# EAGLE schematic SDA390V1_TASLAK (EAGLE 9.6.2)
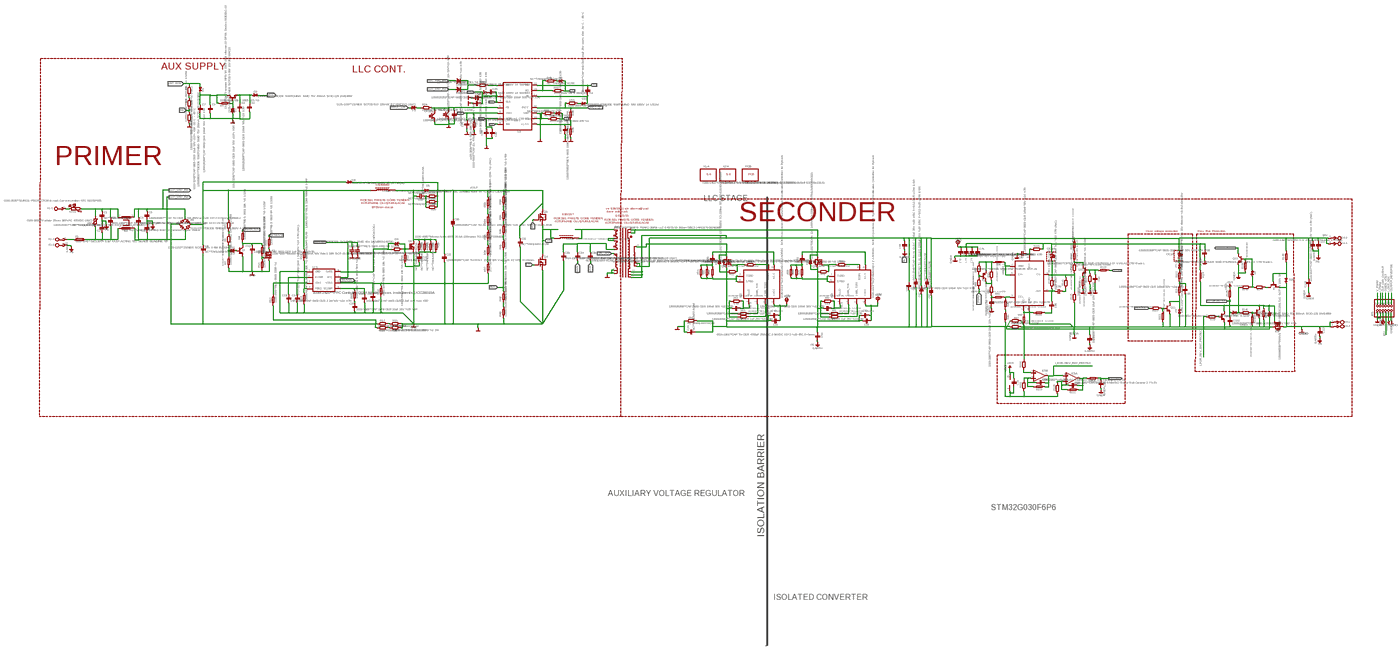
[diagram p0: schematic, sheet 1, overview]
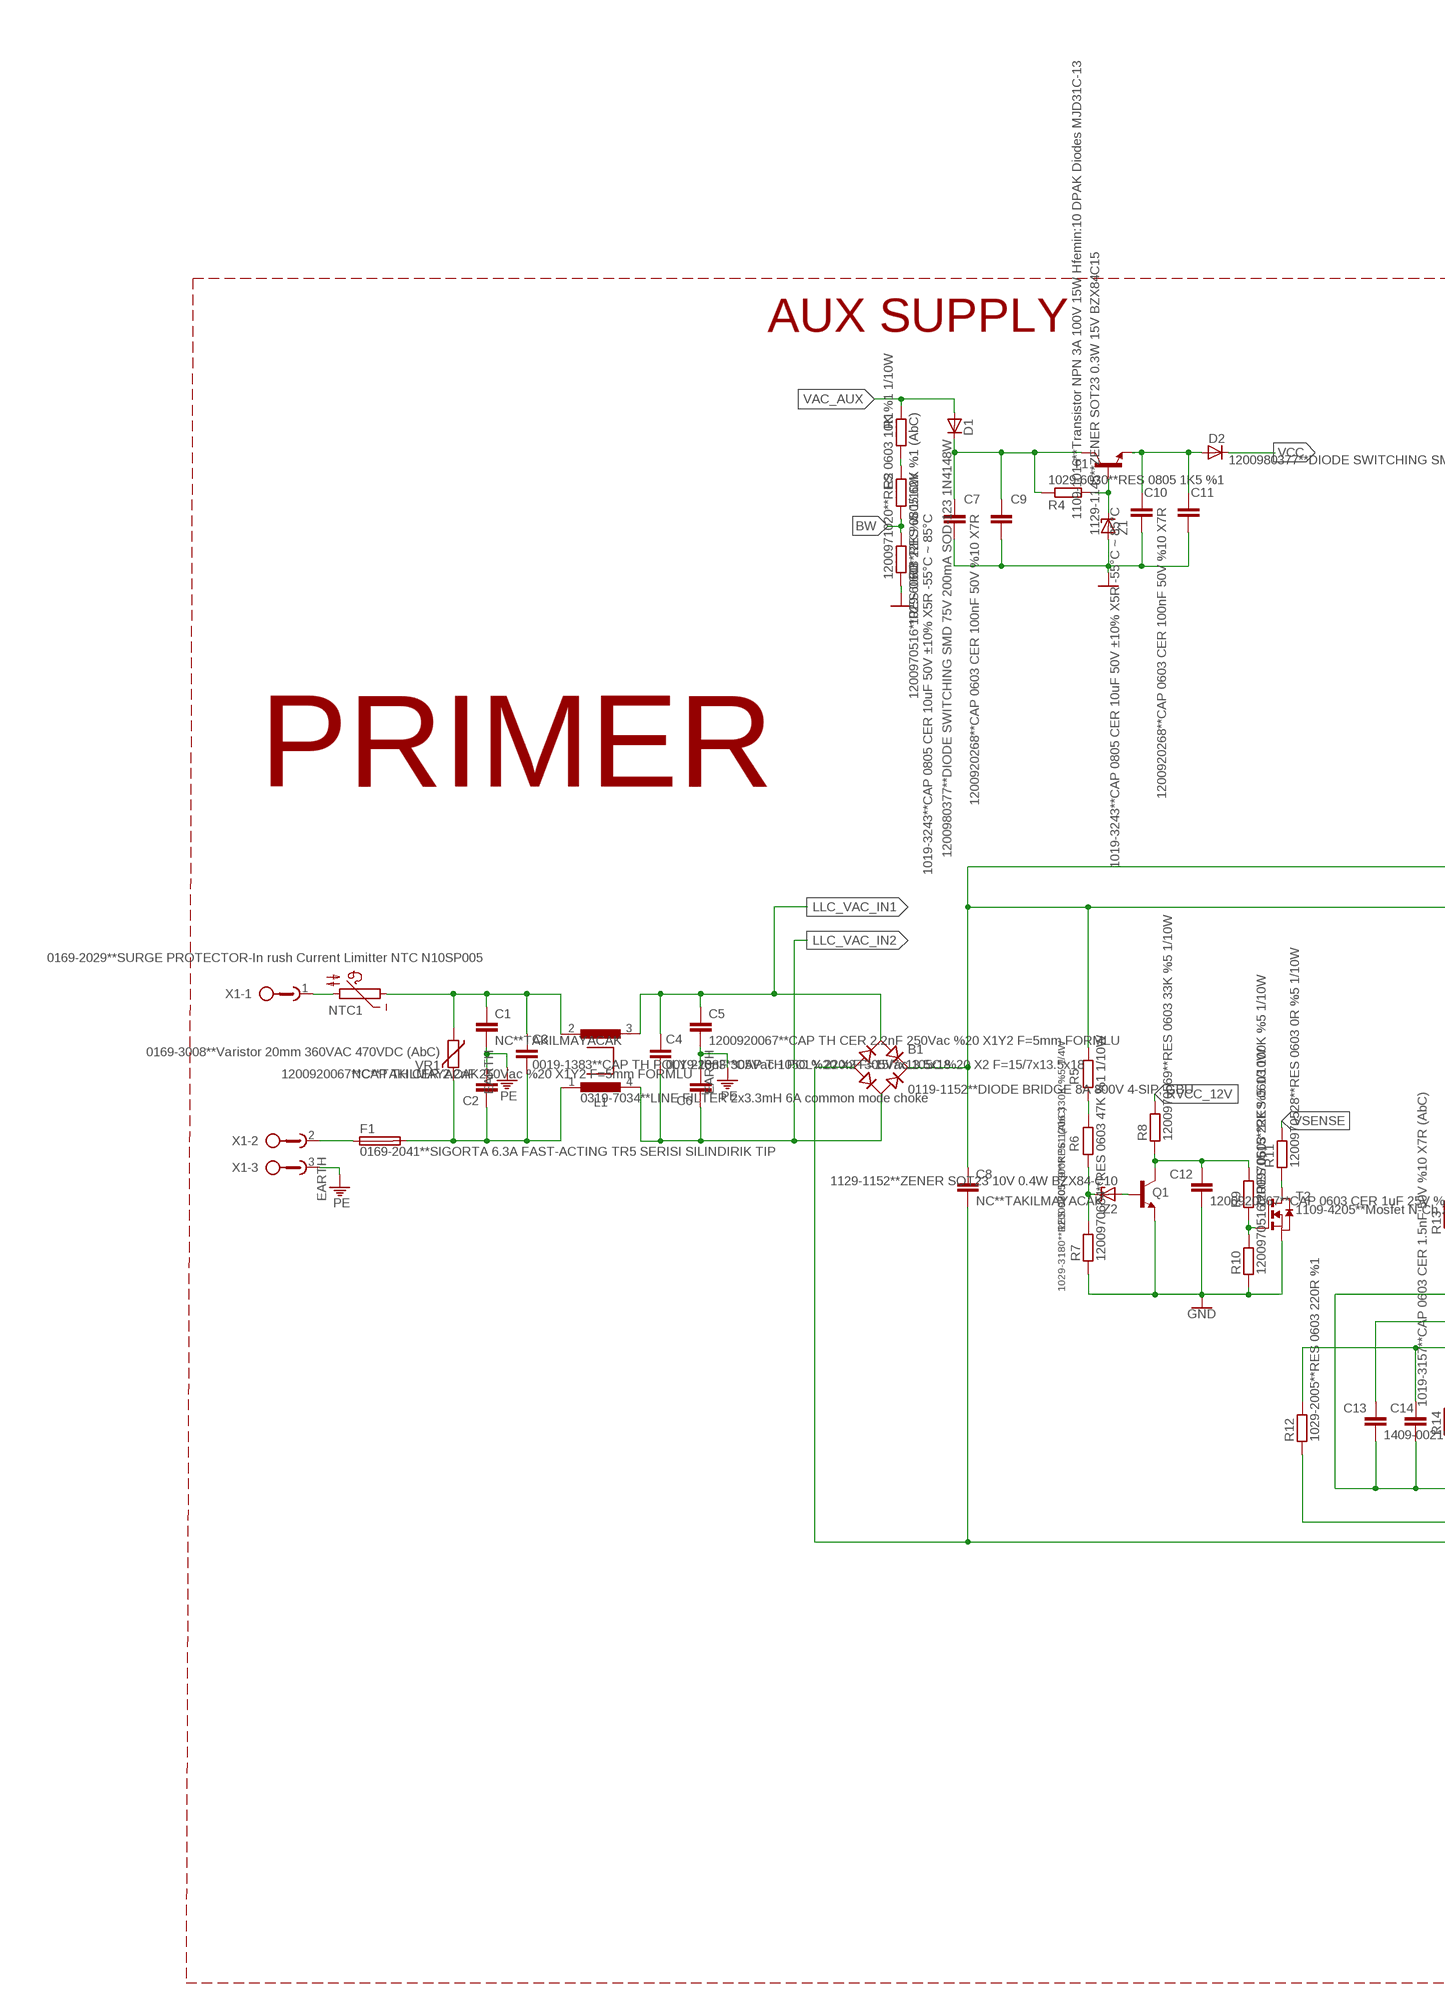
[diagram p1: schematic, sheet 1, part 1 of 4]
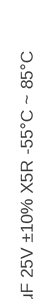
[diagram p2: schematic, sheet 1, part 2 of 4]
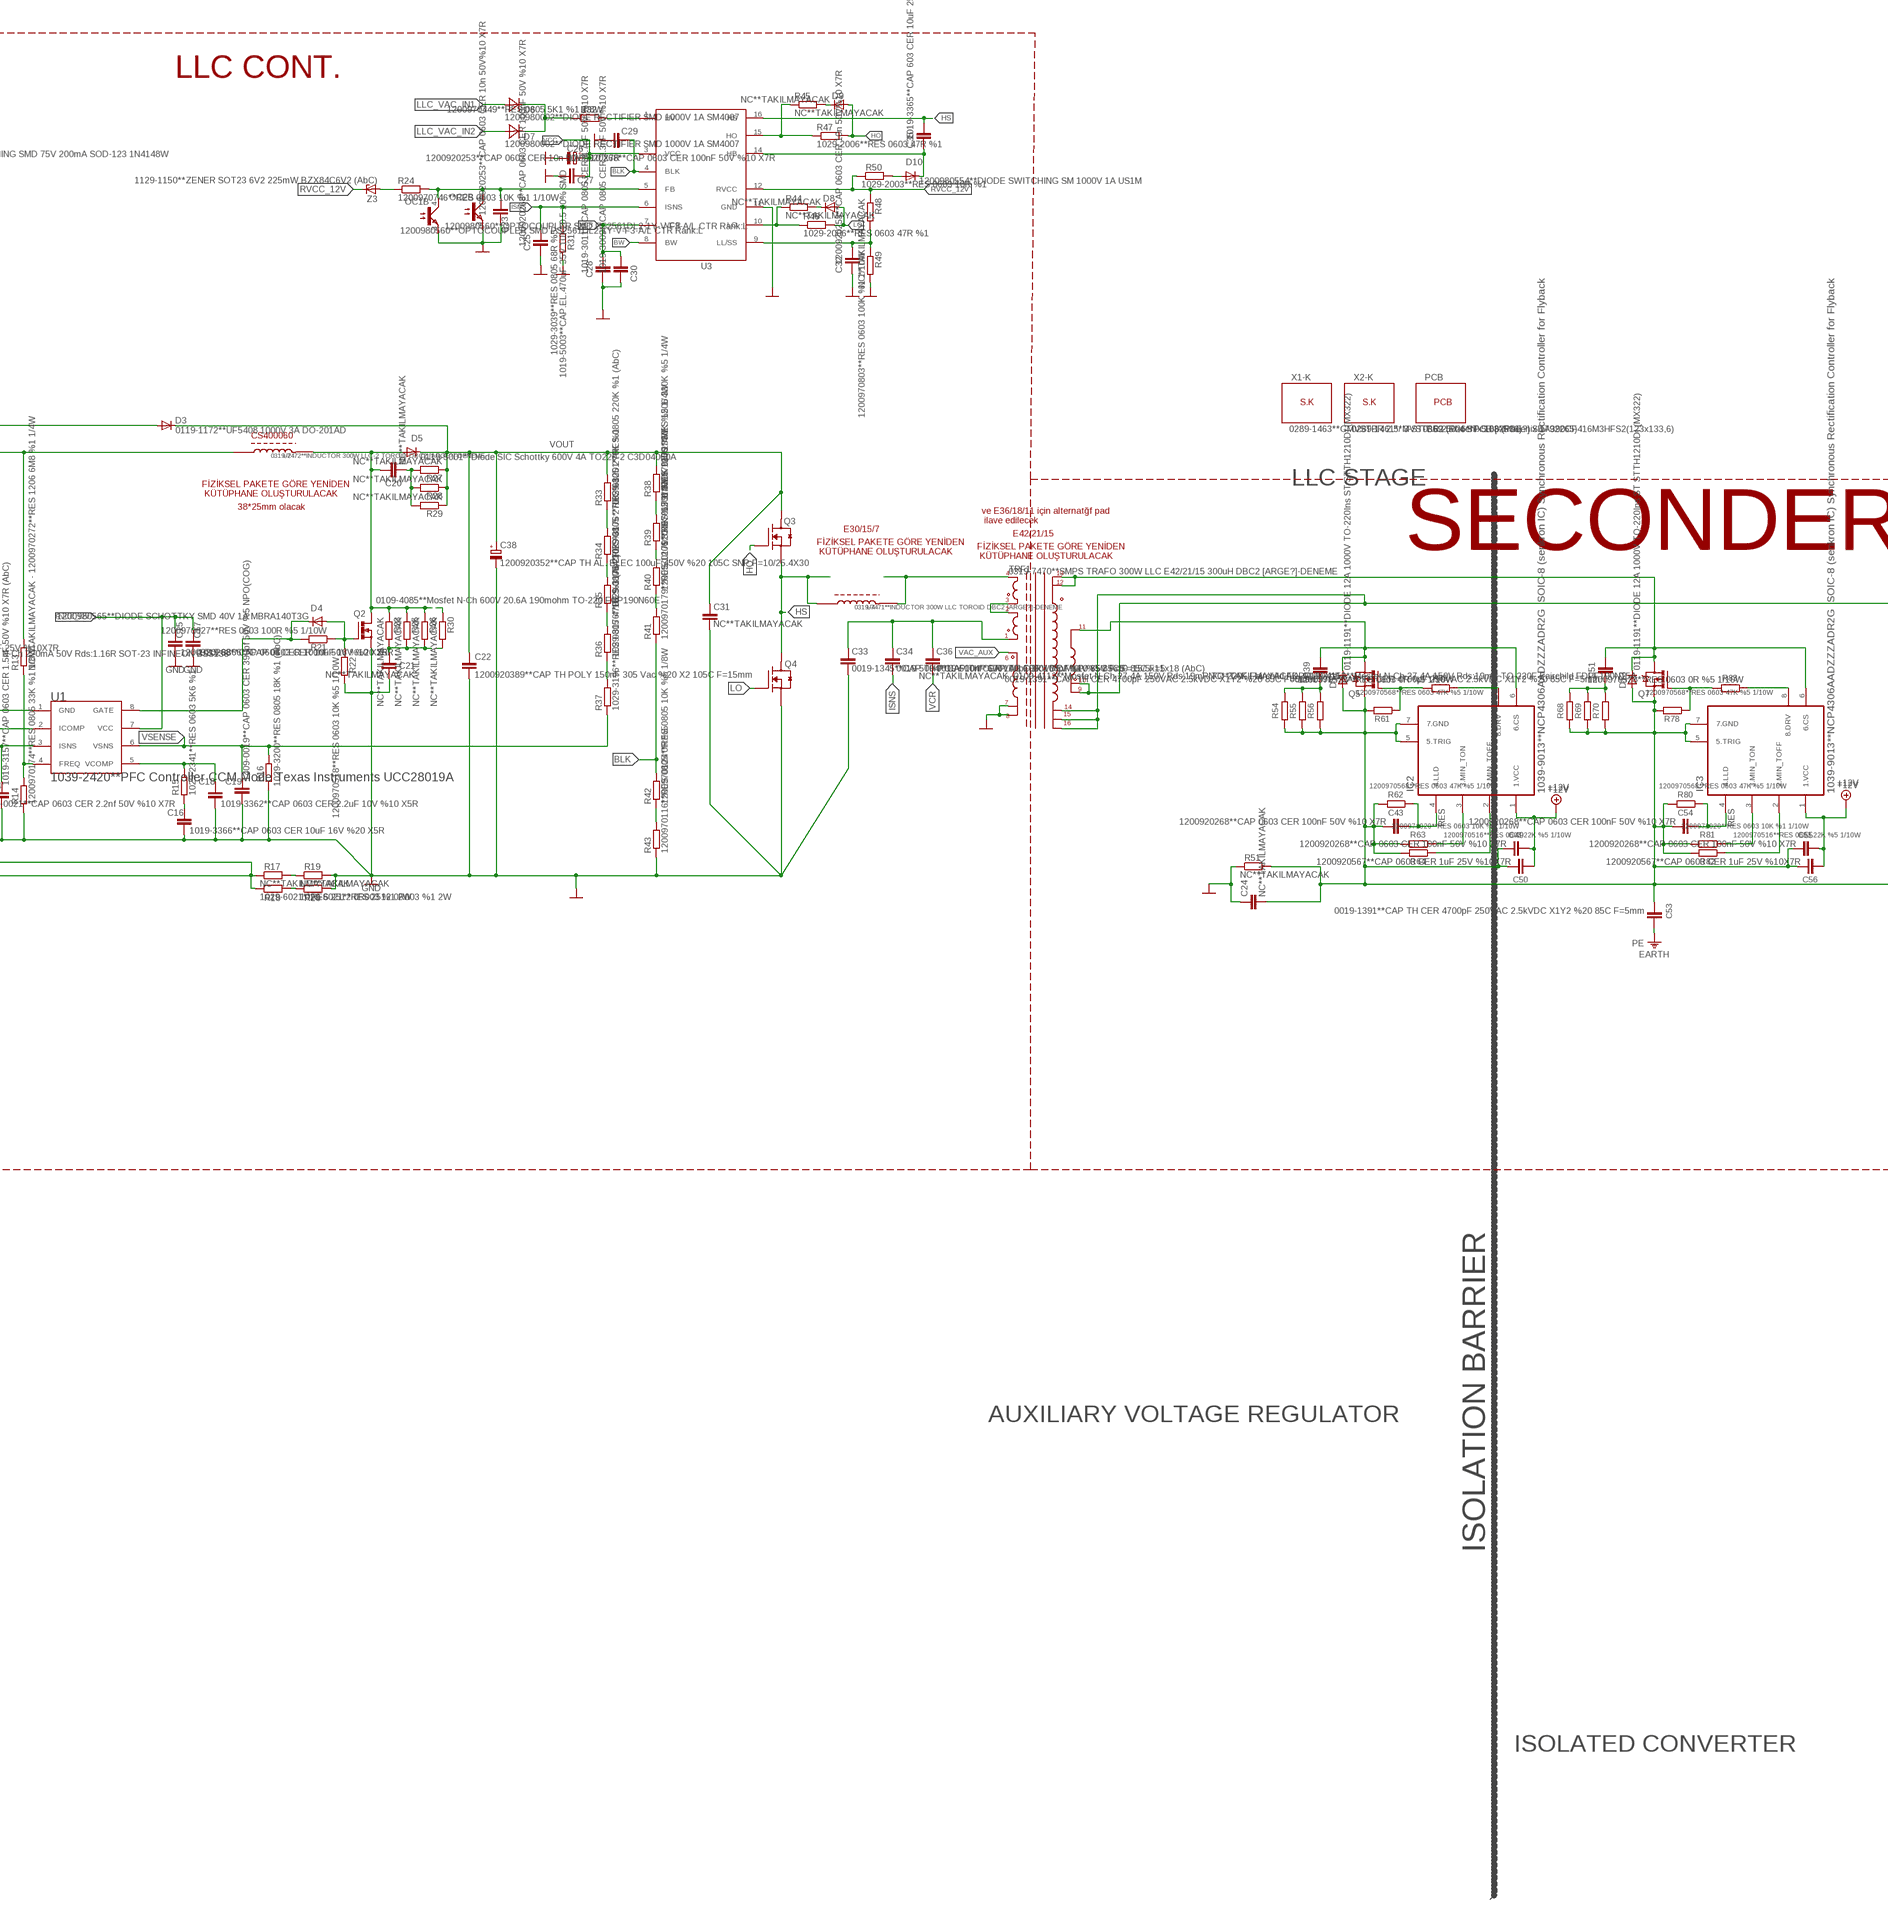
[diagram p3: schematic, sheet 1, part 3 of 4]
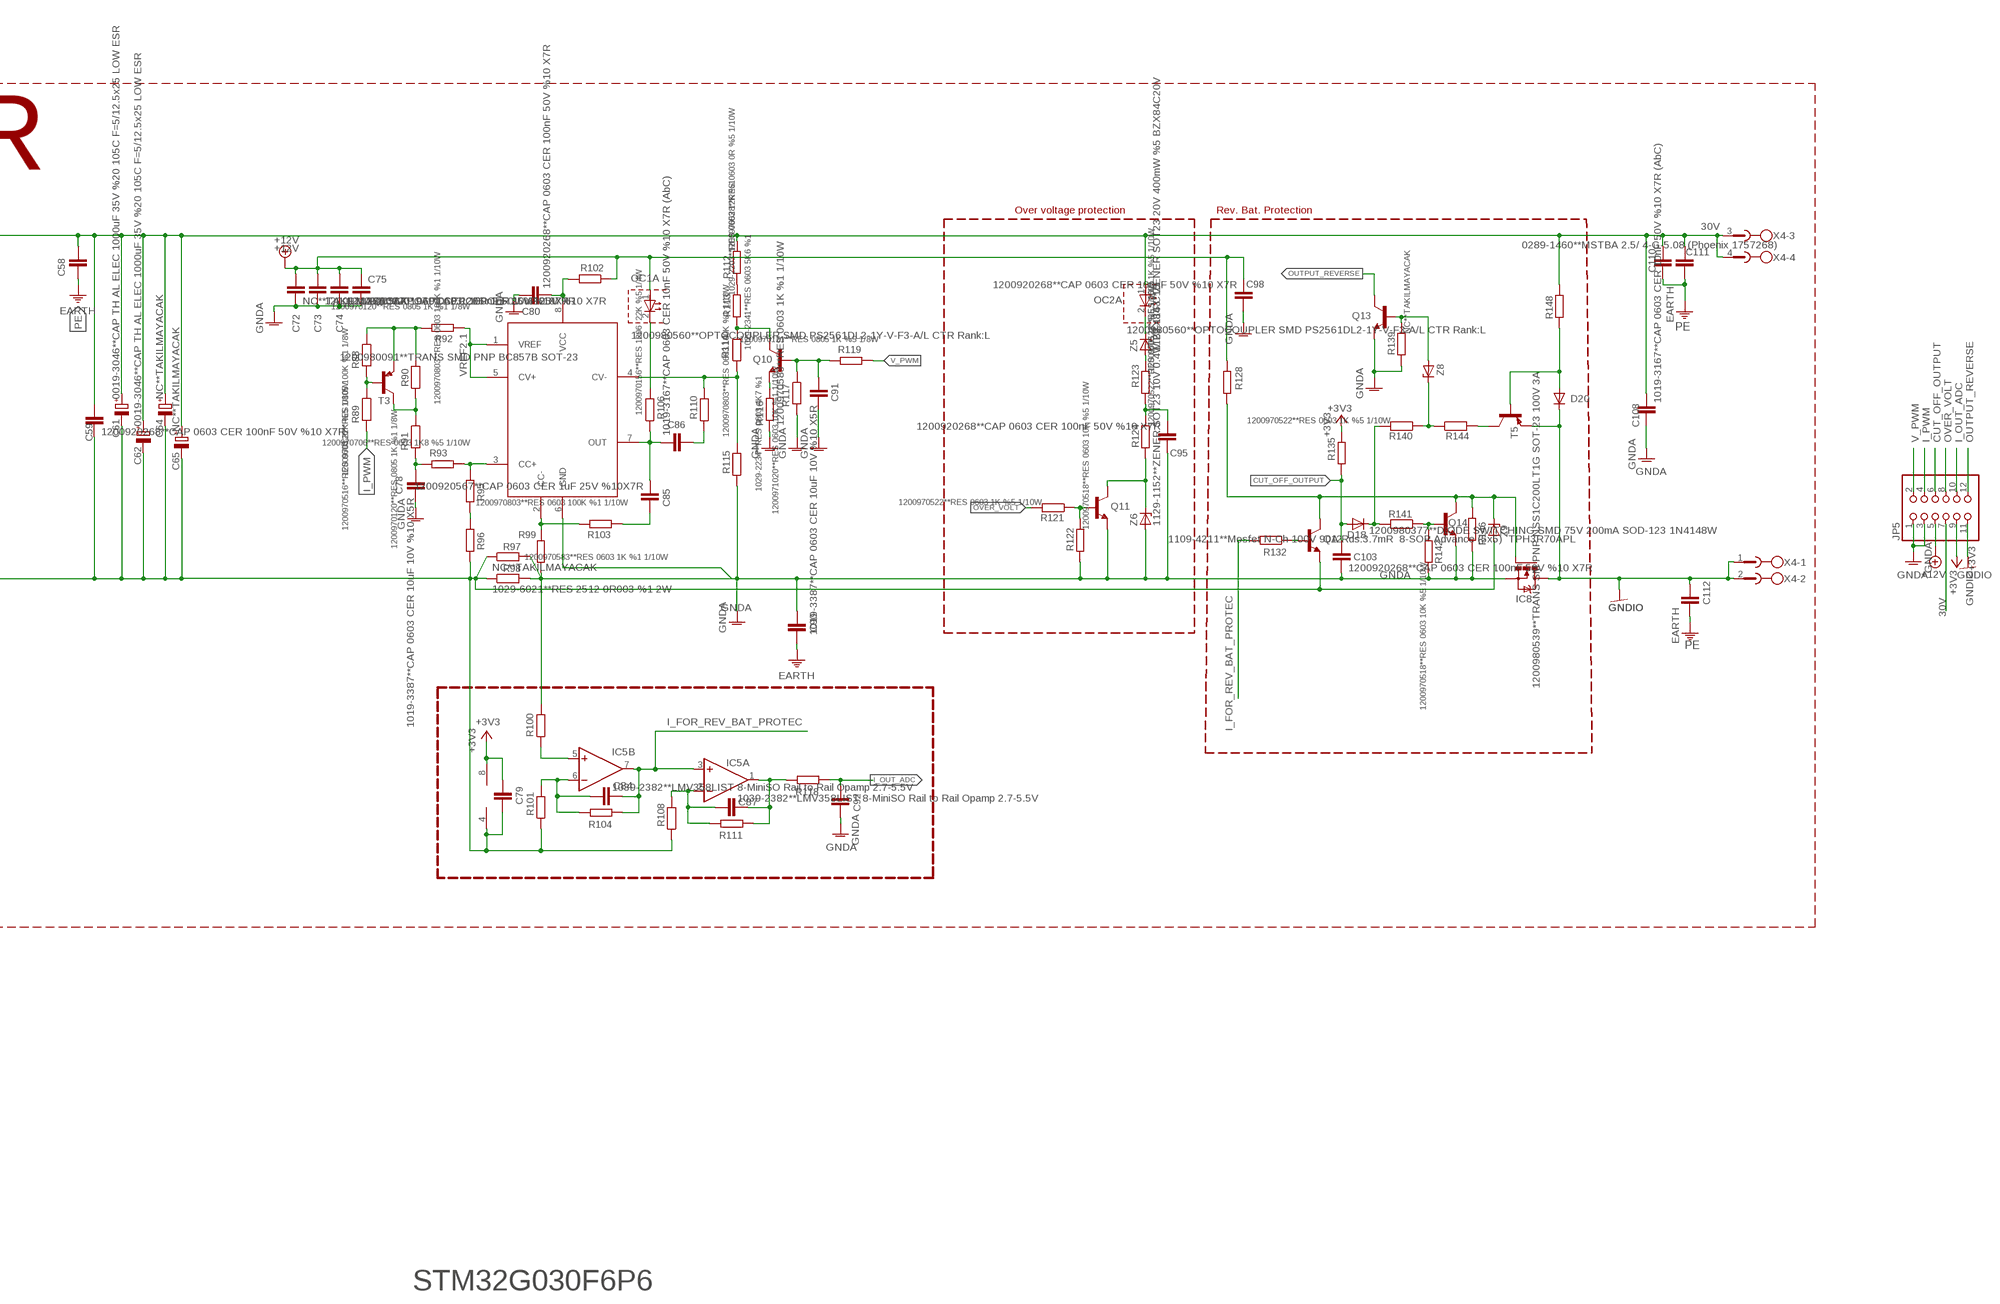
[diagram p4: schematic, sheet 1, part 4 of 4]

## Parts
B1  0119-1152**DIODE BRIDGE 8A 800V 4-SIP, GBU  DıODE_BRIDGE_8A_DIK  [DıODE_BRIDGE_8A_DIK]
C1  NC**TAKILMAYACAK  C-EU050-035X075  [C050-035X075]
C2  NC**TAKILMAYACAK  C-EU050-035X075  [C050-035X075]
C3  0019-1383**CAP TH POLY 220nF 305Vac 105C %20 X2 F=15/7x13.5x18  C-EU150-064X183  [C150-064X183]
C4  0019-1383**CAP TH POLY 220nF 305Vac 105C %20 X2 F=15/7x13.5x18  C-EU150-064X183  [C150-064X183]
C5  1200920067**CAP TH CER 2.2nF 250Vac %20 X1Y2 F=5mm FORMLU  C-EU050-035X075  [C050-035X075]
C6  1200920067**CAP TH CER 2.2nF 250Vac %20 X1Y2 F=5mm FORMLU  C-EU050-035X075  [C050-035X075]
C7  1019-3243**CAP 0805 CER 10uF 50V ±10% X5R -55°C ~ 85°C  C-EUC0805E  [C0805_ENKO]
C8  NC**TAKILMAYACAK  C-EU225-087X268  [C225-087X268]
C9  1200920268**CAP 0603 CER 100nF 50V %10 X7R  C-EUC0603E  [C0603_ENKO]
C10  1019-3243**CAP 0805 CER 10uF 50V ±10% X5R -55°C ~ 85°C  C-EUC0805E  [C0805_ENKO]
C11  1200920268**CAP 0603 CER 100nF 50V %10 X7R  C-EUC0603E  [C0603_ENKO]
C12  1200920567**CAP 0603 CER 1uF 25V %10X7R  C-EUC0603E  [C0603_ENKO]
C13  1409-0021**CAP 0603 CER 2.2nf 50V %10 X7R  C-EUC0603E  [C0603_ENKO]
C14  1019-3157**CAP 0603 CER 1.5nF 50V %10 X7R (AbC)  C-EUC0603E  [C0603_ENKO]
C15  1200920268**CAP 0603 CER 100nF 50V %10 X7R  C-EUC0603E  [C0603_ENKO]
C16  1019-3366**CAP 0603 CER 10uF 16V %20 X5R  C-EUC0603E  [C0603_ENKO]
C17  1019-3366**CAP 0603 CER 10uF 16V %20 X5R  C-EUC0603E  [C0603_ENKO]
C18  1019-3362**CAP 0603 CER 2.2uF 10V %10 X5R  C-EUC0603E  [C0603_ENKO]
C19  1409-0019**CAP 0603 CER 390pf 50V %5 NPO(COG)  C-EUC0603E  [C0603_ENKO]
C20  NC**TAKILMAYACAK  C-EU050-030X075  [C050-030X075]
C21  NC**TAKILMAYACAK  C-EU050-030X075  [C050-030X075]
C22  1200920389**CAP TH POLY 150nF 305 Vac %20 X2 105C F=15mm  C-EU150-054X183  [C150-054X183]
C23  1200920253**CAP 0603 CER 10n 50V%10 X7R  C-EUC0603E  [C0603_ENKO]
C24  NC**TAKILMAYACAK  C075-32X103_DEIF  [C075-32X103_DEIF]
C25  1200920268**CAP 0603 CER 100nF 50V %10 X7R  C-EUC0603E  [C0603_ENKO]
C26  1019-5003**CAP.EL.470uF 35V 10X10.5 20% SMD  CPOL-EU153CLV-1010  [153CLV-1010]
C27  1200920268**CAP 0603 CER 100nF 50V %10 X7R  C-EUC0603E  [C0603_ENKO]
C28  1019-3011**CAP 0805 CER 4.7nF 50V %10 X7R  C-EUC0603E  [C0603_ENKO]
C29  1200920253**CAP 0603 CER 10n 50V%10 X7R  C-EUC0603E  [C0603_ENKO]
C30  1019-3009**CAP 0805 CER 3.3nF 50V %10 X7R  C-EUC0603E  [C0603_ENKO]
C31  NC**TAKILMAYACAK  C-EU150-064X183  [C150-064X183]
C32  1200920253**CAP 0603 CER 10n 50V%10 X7R  C-EUC0603E  [C0603_ENKO]
C33  0019-1345**CAP TH POLY 10nF 600VAC 1000VDC MKP %5 85C F=15/5x11x18 (AbC)  C-EU150-072X183  [C150-072X183]
C34  0019-5004**CAP TH CER 100pF 1kV Y5V %10 85C F=5  C-EU050-055X075  [C050-055X075]
C35  1019-3365**CAP 603 CER 10uF 25V ±10% X5R -55°C ~ 85°C  C-EUC0603E  [C0603_ENKO]
C36  0019-5004**CAP TH CER 100pF 1kV Y5V %10 85C F=5  C-EU050-050X075  [C050-050X075]
C38  1200920352**CAP TH AL. ELEC 100uF 450V %20 105C SNP F=10/25.4X30  CPOL-EUE10-25  [EB25D]
C39  0019-1391**CAP TH CER 4700pF 250VAC 2.5kVDC X1Y2 %20 85C F=5mm  C-EU050-045X075  [C050-045X075]
C43  1200920268**CAP 0603 CER 100nF 50V %10 X7R  C-EUC0603E  [C0603_ENKO]
C49  1200920268**CAP 0603 CER 100nF 50V %10 X7R  C-EUC0603E  [C0603_ENKO]
C50  1200920567**CAP 0603 CER 1uF 25V %10X7R  C-EUC0603E  [C0603_ENKO]
C51  0019-1391**CAP TH CER 4700pF 250VAC 2.5kVDC X1Y2 %20 85C F=5mm  C-EU050-045X075  [C050-045X075]
C53  0019-1391**CAP TH CER 4700pF 250VAC 2.5kVDC X1Y2 %20 85C F=5mm  C-EU050-045X075  [C050-045X075]
C54  1200920268**CAP 0603 CER 100nF 50V %10 X7R  C-EUC0603E  [C0603_ENKO]
C55  1200920268**CAP 0603 CER 100nF 50V %10 X7R  C-EUC0603E  [C0603_ENKO]
C56  1200920567**CAP 0603 CER 1uF 25V %10X7R  C-EUC0603E  [C0603_ENKO]
C58  1200920292**CAP TH CER 2.2nF 300Vac %20 X1Y2 F=7.5mm DxS(13x5)  C075-32X103/C050-035X75  [C075-32X103/C050-035X75]
C59  1200920268**CAP 0603 CER 100nF 50V %10 X7R  C-EUC0603E  [C0603_ENKO]
C61  0019-3046**CAP TH AL ELEC 1000uF 35V %20 105C F=5/12.5x25 LOW ESR  E5-13/E7,5-16  [E5-13/E7,5-16]
C62  0019-3046**CAP TH AL ELEC 1000uF 35V %20 105C F=5/12.5x25 LOW ESR  E5-13/E7,5-16  [E5-13/E7,5-16]
C64  NC**TAKILMAYACAK  E5-13/E7,5-16  [E5-13/E7,5-16]
C65  NC**TAKILMAYACAK  E5-13/E7,5-16  [E5-13/E7,5-16]
C72  NC**TAKILMAYACAK  C-EUC0603E  [C0603_ENKO]
C73  1200920268**CAP 0603 CER 100nF 50V %10 X7R  C-EUC0603E  [C0603_ENKO]
C74  1200920567**CAP 0603 CER 1uF 25V %10X7R  C-EUC0603E  [C0603_ENKO]
C75  1200920197**CAP 1206 CER 10uF 25V %10 X7R  C-EUC1206E  [C1206_ENKO]
C78  1019-3387**CAP 0603 CER 10uF 10V %10 X5R  C-EUC0603E  [C0603_ENKO]
C79  1200920268**CAP 0603 CER 100nF 50V %10 X7R  C-EUC0603E  [C0603_ENKO]
C80  1200920268**CAP 0603 CER 100nF 50V %10 X7R  C-EUC0603E  [C0603_ENKO]
C84  NC**TAKILMAYACAK (Not Fitted)  C-EUC0603E  [C0603_ENKO]
C85  1200920567**CAP 0603 CER 1uF 25V %10X7R  C-EUC0603E  [C0603_ENKO]
C86  1019-3167**CAP 0603 CER 10nF 50V %10 X7R (AbC)  C-EUC0603E  [C0603_ENKO]
C87  1200920371**CAP 0603 CER 150p 50V%5 COG  C-EUC0603E  [C0603_ENKO]
C90  NC**TAKILMAYACAK (Not Fitted)  C-EU050-035X075  [C050-035X075]
C91  1019-3387**CAP 0603 CER 10uF 10V %10 X5R  C-EUC0603E  [C0603_ENKO]
C92  1200920268**CAP 0603 CER 100nF 50V %10 X7R  C-EUC0603E  [C0603_ENKO]
C95  1200920268**CAP 0603 CER 100nF 50V %10 X7R  C-EUC0603E  [C0603_ENKO]
C98  1200920268**CAP 0603 CER 100nF 50V %10 X7R  C-EUC0603E  [C0603_ENKO]
C103  1200920268**CAP 0603 CER 100nF 50V %10 X7R  C-EUC0603E  [C0603_ENKO]
C108  1019-3167**CAP 0603 CER 10nF 50V %10 X7R (AbC)  C-EUC0603E  [C0603_ENKO]
C110  0019-1391**CAP TH CER 4700pF 250VAC 2.5kVDC X1Y2 %20 85C F=5mm  C-EU050-035X075  [C050-035X075]
C111  0019-1391**CAP TH CER 4700pF 250VAC 2.5kVDC X1Y2 %20 85C F=5mm  C-EU050-035X075  [C050-035X075]
C112  0019-1391**CAP TH CER 4700pF 250VAC 2.5kVDC X1Y2 %20 85C F=5mm  C-EU050-035X075  [C050-035X075]
D1  1200980377**DIODE SWITCHING SMD 75V 200mA SOD-123 1N4148W  DIODE-SOD123  [SOD123]
D2  1200980377**DIODE SWITCHING SMD 75V 200mA SOD-123 1N4148W  DIODE-SOD123  [SOD123]
D3  0119-1172**UF5408 1000V 3A DO-201AD  DIODE_D0201-23  [DIODE_D0201-23]
D4  1200980565**DIODE SCHOTTKY SMD 40V 1A MBRA140T3G  DIODE-SOD106-R  [SOD106-R]
D5  0119-5001**Diode SIC Schottky 600V 4A TO220-2 C3D04060A  DIODE_12A_1000V_TO220  [DIODE_12A_1000V_TO220]
D6  1200980002**DIODE RECTIFIER SMD 1000V 1A SM4007  M7_DC_DIYOT  [M7_DC_DIYOT]
D7  1200980002**DIODE RECTIFIER SMD 1000V 1A SM4007  M7_DC_DIYOT  [M7_DC_DIYOT]
D8  NC**TAKILMAYACAK  DIODE-SOD106-R  [SOD106-R]
D9  NC**TAKILMAYACAK  DIODE-SOD106-R  [SOD106-R]
D10  1200980554**DIODE SWITCHING SM 1000V 1A US1M  DIODE-SOD106-R  [SOD106-R]
D11  0119-1191**DIODE 12A 1000V TO-220Ins ST STTH1210DI (MX322)  BYW80  [TO220ACS]
D13  0119-1191**DIODE 12A 1000V TO-220Ins ST STTH1210DI (MX322)  BYW80  [TO220ACS]
D18  1200980377**DIODE SWITCHING SMD 75V 200mA SOD-123 1N4148W  DIODE-SOD123  [SOD123]
D20  1200980377**DIODE SWITCHING SMD 75V 200mA SOD-123 1N4148W  DIODE-SOD123  [SOD123]
F1  0169-2041**SIGORTA 6.3A FAST-ACTING TR5 SERISI SILINDIRIK TIP  19560  [19560]
IC2  1039-9013**NCP4306AADZZZADR2G SOIC-8 (senkron IC) Synchronous Rectification Controller for Flyback  NCP4306  [NCP4306]
IC3  1039-9013**NCP4306AADZZZADR2G SOIC-8 (senkron IC) Synchronous Rectification Controller for Flyback  NCP4306  [NCP4306]
IC4  1039-2224**TSM1011ID SO-8 Constant Voltage and Constant Current Controller  TSM1011  [SO-8]
IC5  1039-2382**LMV358LIST 8-MiniSO Rail to Rail Opamp 2.7-5.5V  LMV358MM  [MSOP08]
IC8  1109-4211**Mosfet N-Ch 100V 90A Rds:3.7mR 8-SOP Advance (5x5) TPH3R70APL  TPH6R30ANL  [TPH6R30ANL]
JP5  PINHD-2X6_2.54  [2X06]
L1  0319-7034**LINE FILTER 2x3.3mH 6A common mode choke  EPCOS_B82724J  [EPCOS_B82724J]
NTC1  0169-2029**SURGE PROTECTOR-In rush Current Limitter NTC N10SP005  SENS_NTC  [SENS_NTC]
OC1  1200980560**OPTOCOUPLER SMD PS2561DL2-1Y-V-F3-A/L CTR Rank:L  PS2561DL2-1_OPTO1  [PS2561DL2-1_OPTO1]
OC2  1200980560**OPTOCOUPLER SMD PS2561DL2-1Y-V-F3-A/L CTR Rank:L  PS2561DL2-1_OPTO1  [PS2561DL2-1_OPTO1]
PCB  0369-5026**PCB [ARGE?] SDA390CF416M3HFS2(123x133,6)  PCB  [PCB]
Q1  1200980090**TRANS SMD NPN BC847B SOT-23  BC846ALT1SMD  [SOT23]
Q2  0109-4085**Mosfet N-Ch 600V 20.6A 190mohm TO-220 FCP190N60E  PMOSFET_NTO220BV  [TO220BV]
Q3  0109-4091**Mosfet N-Ch 800V 9A 0.16R TO-220FP Vishay SIHA24N80AE-GE3  ISO_TO_220  [ISO_TO_220]
Q4  0109-4091**Mosfet N-Ch 800V 9A 0.16R TO-220FP Vishay SIHA24N80AE-GE3  ISO_TO_220  [ISO_TO_220]
Q5  NC**TAKILMAYACAK 0109-4112**Mosfet N-Ch 27.4A 150V Rds:19mR TO-220F Fairchild FDPF190N15A  STP5NA50  [TO220BV]
Q7  NC**TAKILMAYACAK 0109-4112**Mosfet N-Ch 27.4A 150V Rds:19mR TO-220F Fairchild FDPF190N15A  STP5NA50  [TO220BV]
Q10  1200980090**TRANS SMD NPN BC847B SOT-23  BC846BLT1SMD  [SOT23]
Q11  1200980090**TRANS SMD NPN BC847B SOT-23  BC846ALT1SMD  [SOT23]
Q12  1200980090**TRANS SMD NPN BC847B SOT-23  BC846ALT1SMD  [SOT23]
Q13  NC**TAKILMAYACAK  BC846ALT1SMD  [SOT23]
Q14  1200980090**TRANS SMD NPN BC847B SOT-23  BC846ALT1SMD  [SOT23]
R1  1029-6060**RES 0805 62K %1 (AbC)  R-EU_R0603E  [R0603_ENKO]
R2  1200970516**RES 0603 22K %5 1/10W  R-EU_R0603E  [R0603_ENKO]
R3  1200971020**RES 0603 10K %1 1/10W  R-EU_R0603E  [R0603_ENKO]
R4  1029-6030**RES 0805 1K5 %1  R-EU_R0805E  [R0805_ENKO]
R5  1200970179**RES 1206 330K %5 1/4W  R-EU_R1206E  [R1206_ENKO]
R6  1029-3180**RES 0805 300K %1 (AbC)  R-EU_R1206E  [R1206_ENKO]
R7  1200970684**RES 0603 47K %1 1/10W  R-EU_R0603E  [R0603_ENKO]
R8  1200970569**RES 0603 33K %5 1/10W  R-EU_R0603E  [R0603_ENKO]
R9  1200970515**RES 0603 100K %5 1/10W  R-EU_R0603E  [R0603_ENKO]
R10  1200970516**RES 0603 22K %5 1/10W  R-EU_R0603E  [R0603_ENKO]
R11  1200970528**RES 0603 0R %5 1/10W  R-EU_R0603E  [R0603_ENKO]
R12  1029-2005**RES 0603 220R %1  R-EU_R0603E  [R0603_ENKO]
R13  NC**TAKILMAYACAK - 1200970272**RES 1206 6M8 %1 1/4W  R-EU_R1206E  [R1206_ENKO]
R14  1200970174**RES 0805 33K %1 1/8W  R-EU_R0805E  [R0805_ENKO]
R15  1029-2341**RES 0603 5K6 %1  R-EU_R0603E  [R0603_ENKO]
R16  1029-3200**RES 0805 18K %1 (AbC)  R-EU_R0805E  [R0805_ENKO]
R17  NC**TAKILMAYACAK  R-EU_R2512  [R2512]
R18  1029-6021**RES 2512 0R003 %1 2W  R-EU_R2512  [R2512]
R19  NC**TAKILMAYACAK  R-EU_R2512  [R2512]
R20  1029-6021**RES 2512 0R003 %1 2W  R-EU_R2512  [R2512]
R21  1200970627**RES 0603 100R %5 1/10W  R-EU_R0603E  [R0603_ENKO]
R22  1200970518**RES 0603 10K %5 1/10W  R-EU_R0603E  [R0603_ENKO]
R23  NC**TAKILMAYACAK  R-EU_R1206E  [R1206_ENKO]
R24  1200970746**RES 0603 10K %1 1/10W  R-EU_R0603E  [R0603_ENKO]
R25  NC**TAKILMAYACAK  R-EU_R1206E  [R1206_ENKO]
R26  NC**TAKILMAYACAK  R-EU_R1206E  [R1206_ENKO]
R27  NC**TAKILMAYACAK  R-EU_R1206E  [R1206_ENKO]
R28  NC**TAKILMAYACAK  R-EU_R1206E  [R1206_ENKO]
R29  NC**TAKILMAYACAK  R-EU_R1206E  [R1206_ENKO]
R30  NC**TAKILMAYACAK  R-EU_R1206E  [R1206_ENKO]
R31  1029-3039**RES 0805 68R %5  R-EU_R0603E  [R0603_ENKO]
R32  1200970449**RES 0805 5K1 %1 1/8W  R-EU_R0805E  [R0805_ENKO]
R33  1029-3201**RES 0805 220K %1 (AbC)  R-EU_R0805E  [R0805_ENKO]
R34  1029-3176**RES 0805 270K %1  R-EU_R0805E  [R0805_ENKO]
R35  1029-3176**RES 0805 270K %1  R-EU_R0805E  [R0805_ENKO]
R36  1029-3176**RES 0805 270K %1  R-EU_R0805E  [R0805_ENKO]
R37  1029-3196**RES 0805 470K %1 (AbC)  R-EU_R0805E  [R0805_ENKO]
R38  1200970179**RES 1206 330K %5 1/4W  R-EU_R1206E  [R1206_ENKO]
R39  1200970179**RES 1206 330K %5 1/4W  R-EU_R1206E  [R1206_ENKO]
R40  1200970179**RES 1206 330K %5 1/4W  R-EU_R1206E  [R1206_ENKO]
R41  1200970179**RES 1206 330K %5 1/4W  R-EU_R1206E  [R1206_ENKO]
R42  1200970124**RES 0805 10K %5 1/8W  R-EU_R0805E  [R0805_ENKO]
R43  1200970116**RES 0805 0R %5  R-EU_R0805E  [R0805_ENKO]
R44  NC**TAKILMAYACAK  R-EU_R0603E  [R0603_ENKO]
R45  NC**TAKILMAYACAK  R-EU_R0603E  [R0603_ENKO]
R46  1029-2006**RES 0603 47R %1  R-EU_R0603E  [R0603_ENKO]
R47  1029-2006**RES 0603 47R %1  R-EU_R0603E  [R0603_ENKO]
R48  NC**TAKILMAYACAK  R-EU_R0603E  [R0603_ENKO]
R49  1200970803**RES 0603 100K %1 1/10W  R-EU_R0603E  [R0603_ENKO]
R50  1029-2003**RES 0603 10R %1  R-EU_R0603E  [R0603_ENKO]
R51  NC**TAKILMAYACAK  R-EU_0207/15  [0207/15]
R54  1029-4045**RES 1206 22R %5  R-EU_R1206E  [R1206_ENKO]
R55  NC**TAKILMAYACAK  R-EU_R1206E  [R1206_ENKO]
R56  1029-4045**RES 1206 22R %5  R-EU_R1206E  [R1206_ENKO]
R61  1200970568**RES 0603 47K %5 1/10W  R-EU_R0603E  [R0603_ENKO]
R62  1200970568**RES 0603 47K %5 1/10W  R-EU_R0603E  [R0603_ENKO]
R63  1200971020**RES 0603 10K %1 1/10W  R-EU_R0603E  [R0603_ENKO]
R64  1200970516**RES 0603 22K %5 1/10W  R-EU_R0603E  [R0603_ENKO]
R65  1200970528**RES 0603 0R %5 1/10W  R-EU_R0603E  [R0603_ENKO]
R68  1029-4045**RES 1206 22R %5  R-EU_R1206E  [R1206_ENKO]
R69  NC**TAKILMAYACAK  R-EU_R1206E  [R1206_ENKO]
R70  1029-4045**RES 1206 22R %5  R-EU_R1206E  [R1206_ENKO]
R78  1200970568**RES 0603 47K %5 1/10W  R-EU_R0603E  [R0603_ENKO]
R80  1200970568**RES 0603 47K %5 1/10W  R-EU_R0603E  [R0603_ENKO]
R81  1200971020**RES 0603 10K %1 1/10W  R-EU_R0603E  [R0603_ENKO]
R82  1200970516**RES 0603 22K %5 1/10W  R-EU_R0603E  [R0603_ENKO]
R83  1200970528**RES 0603 0R %5 1/10W  R-EU_R0603E  [R0603_ENKO]
R88  1200970126**RES 0805 100K %1 1/8W  R-EU_R0805E  [R0805_ENKO]
R89  1200970516**RES 0603 22K %5 1/10W  R-EU_R0603E  [R0603_ENKO]
R90  1200970803**RES 0603 100K %1 1/10W  R-EU_R0603E  [R0603_ENKO]
R91  1200970120**RES 0805 1K %1 1/8W  R-EU_R0805E  [R0805_ENKO]
R92  1200970120**RES 0805 1K %1 1/8W  R-EU_R0805E  [R0805_ENKO]
R93  1200970706**RES 0603 1K8 %5 1/10W  R-EU_R0603E  [R0603_ENKO]
R95  1029-2003**RES 0603 10R %1  R-EU_R0603E  [R0603_ENKO]
R96  1029-3416**RES 0805 47R %1 (AbC) (MX322)  R-EU_R0805E  [R0805_ENKO]
R97  NC**TAKILMAYACAK  R-EU_R2512  [R2512]
R98  1029-6021**RES 2512 0R003 %1 2W  R-EU_R2512  [R2512]
R99  1200970583**RES 0603 1K %1 1/10W  R-EU_R0603E  [R0603_ENKO]
R100  1200970522**RES 0603 1K %5 1/10W  R-EU_R0603E  [R0603_ENKO]
R101  1200970522**RES 0603 1K %5 1/10W  R-EU_R0603E  [R0603_ENKO]
R102  1029-2003**RES 0603 10R %1  R-EU_R0603E  [R0603_ENKO]
R103  1200970803**RES 0603 100K %1 1/10W  R-EU_R0603E  [R0603_ENKO]
R104  1029-2234**RES 0603 4K7 %1  R-EU_R0603E  [R0603_ENKO]
R106  1200970156**RES 1206 22K %5 1/4W  R-EU_R1206E  [R1206_ENKO]
R108  1200970583**RES 0603 1K %1 1/10W  R-EU_R0603E  [R0603_ENKO]
R110  1200970803**RES 0603 100K %1 1/10W  R-EU_R0603E  [R0603_ENKO]
R111  1029-6089**RES 0603 6K8 %5  R-EU_R0603E  [R0603_ENKO]
R112  1200970528**RES 0603 0R %5 1/10W  R-EU_R0603E  [R0603_ENKO]
R113  1029-2203**RES 0603 12K %1  R-EU_R0603E  [R0603_ENKO]
R114  1029-2341**RES 0603 5K6 %1  R-EU_R0603E  [R0603_ENKO]
R115  1029-2234**RES 0603 4K7 %1  R-EU_R0603E  [R0603_ENKO]
R116  1200970583**RES 0603 1K %1 1/10W  R-EU_R0603E  [R0603_ENKO]
R117  1200971020**RES 0603 10K %1 1/10W  R-EU_R0603E  [R0603_ENKO]
R118  1200970522**RES 0603 1K %5 1/10W  R-EU_R0603E  [R0603_ENKO]
R119  1200970121**RES 0805 1K %5 1/8W  R-EU_R0805E  [R0805_ENKO]
R121  1200970522**RES 0603 1K %5 1/10W  R-EU_R0603E  [R0603_ENKO]
R122  1200970518**RES 0603 10K %5 1/10W  R-EU_R0603E  [R0603_ENKO]
R123  1200970522**RES 0603 1K %5 1/10W  R-EU_R0603E  [R0603_ENKO]
R124  1200970522**RES 0603 1K %5 1/10W  R-EU_R0603E  [R0603_ENKO]
R128  1200970515**RES 0603 100K %5 1/10W  R-EU_R0603E  [R0603_ENKO]
R132  1200970522**RES 0603 1K %5 1/10W  R-EU_R0603E  [R0603_ENKO]
R135  1200970516**RES 0603 22K %5 1/10W  R-EU_R0603E  [R0603_ENKO]
R139  NC**TAKILMAYACAK  R-EU_R0603E  [R0603_ENKO]
R140  1200970522**RES 0603 1K %5 1/10W  R-EU_R0603E  [R0603_ENKO]
R141  1200970522**RES 0603 1K %5 1/10W  R-EU_R0603E  [R0603_ENKO]
R142  1200970518**RES 0603 10K %5 1/10W  R-EU_R0603E  [R0603_ENKO]
R144  1029-2337**RES 0603 39K %1  R-EU_R0603E  [R0603_ENKO]
R146  1200970585**RES 0603 1M %5 1/10W  R-EU_R0603E  [R0603_ENKO]
R148  1029-6015**RES 1206 56K %5  R-EU_R1206E  [R1206_ENKO]
T1  1109-1016**Transistor NPN 3A 100V 15W Hfemin:10 DPAK Diodes MJD31C-13  MJD31  [DPAK]
T2  1109-4205**Mosfet N-Ch 220mA 50V Rds:1.16R SOT-23 INFINEON BSS138  NMOSSOT23  [SOT-23]
T3  1200980091**TRANS SMD PNP BC857B SOT-23  BC856B-PNP-SOT23-BEC  [SOT23-BEC]
T5  1200980539**TRANS SM PNP NSS1C200LT1G SOT-23 100V 3A  BC856B-PNP-SOT23-BEC  [SOT23-BEC]
TRF1  0319-7470**SMPS TRAFO 300W LLC E42/21/15 300uH DBC2 [ARGE?]-DENEME  DEIF_TRF_300W_2  [DEIF_TRF_300W_2]
U1  1039-2420**PFC Controller CCM Mode Texas Instruments UCC28019A  UCC28180  [UCC28180]
U2  0319-7472**INDUCTOR 300W LLC-2 TOROID DBC2 [ARGE?]-DENEME  IND_TOROID  [IND_TOROID]
U3  1039-2421**LLC Controller Texas Instruments UCC256301  UCC256301  [SOIC16_UCC256301]
U4  0319-7471**INDUCTOR 300W LLC TOROID DBC2 [ARGE?]-DENEME  IND_TOROID  [IND_TOROID]
VR1  0169-3008**Varistor 20mm 360VAC 470VDC (AbC)  VITRA_VARISTOR  [VITRA_VARISTOR]
X1  0289-1462**GMSTBA 2.5/ 3-G-7.62 (Phoenix 1766246)  GMSTBA3  [GMSTBA3]
X1-K  0289-1463**GMVSTBR 2.5/ 3-ST-7.62 (Phoenix 1832536)  SOKET  [SOKET]
X2-K  0289-1461**MVSTBR 2.5/ 4-ST-5.08 (Phoenix 1792265)  SOKET  [SOKET]
X4  0289-1460**MSTBA 2.5/ 4-G-5.08 (Phoenix 1757268)  MSTBA4  [MSTBA4]
Z1  1129-1145**ZENER SOT23 0.3W 15V BZX84C15  ZENER-DIODESOT23  [SOT23]
Z2  1129-1152**ZENER SOT23 10V 0.4W BZX84-C10  ZENER-DIODESOT23  [SOT23]
Z3  1129-1150**ZENER SOT23 6V2 225mW BZX84C6V2 (AbC)  ZENER-DIODESOT23  [SOT23]
Z5  1129-1163**ZENER SOT23 20V 400mW %5 BZX84C20V  ZENER-DIODESOT23  [SOT23]
Z6  1129-1152**ZENER SOT23 10V 0.4W BZX84-C10  ZENER-DIODESOT23  [SOT23]
Z8  NC**TAKILMAYACAK  ZENER-DIODESOT23  [SOT23]
Z9  1129-1150**ZENER SOT23 6V2 225mW BZX84C6V2 (AbC)  ZENER-DIODESOT23  [SOT23]

## Nets
30V: C58.1 C58.3 C59.1 C61.+ C61.+1(+) C62.+ C62.+1(+) C64.+ C64.+1(+) C65.+ C65.+1(+) C108.2 C110.1 C111.1 JP5.7 OC2.1 R112.2 R148.1 TRF1.6.1 TRF1.6.2 TRF1.6.5 TRF1.7 TRF1.11 TRF1.12 TRF1.13 TRF1.19 TRF1.20 TRF1.24 TRF1.25 TRF1.27 TRF1.31 TRF1.32 TRF1.38 TRF1.40 TRF1.41 TRF1.45 TRF1.46 TRF1.47 X4.3 X4.4
+3V3: C79.1 IC5.8(P:V+) JP5.9 R135.2
+12V: C49.2 C50.2 C55.2 C56.2 C72.1 C73.1 C74.1 C75.1 C98.2 IC2.1(1.VCC) IC3.1(1.VCC) JP5.5 OC1.1 R102.1 R128.2
BLK: C29.2 R41.1 R42.2 U3.4(BLK)
BW: R2.2 R3.2 U3.8(BW)
CUT_OFF_OUTPUT: C103.1 D18.A JP5.6 R135.1
GATE1: IC8.GATE(G4) Q12.3(C) Q14.3(C) R128.1 R146.2 Z9.3(C)
GND: C7.1 C9.1 C10.1 C11.1 C12.2 C13.2 C14.2 C15.2 C16.2 C17.2 C18.2 C19.2 C21.1 C22.2 C23.2 C24.P$1 C25.2 C26.- C27.2 C28.2 C29.1 C30.2 C31.2 C32.2 C33.2 C38.- OC1.3 OC2.3 Q1.2(E) Q2.S Q4.3(S) R3.1 R7.1 R10.1 R14.1 R16.1 R19.2 R20.2 R22.2 R31.2 R43.1 R49.2 R51.1 T2.2(S) TRF1.4 TRF1.6 TRF1.14 TRF1.26 TRF1.33 TRF1.39 TRF1.48 TRF1.49 U1.1(GND) U3.11(GND) Z1.1(A)
GNDA: C72.2 C73.2 C74.2 C75.2 C78.1 C80.1 C90.2 C91.1 C92.1 C95.1 C98.1 C103.2 C108.1 IC4.6(GND) IC8.S1(S123) IC8.S2(S123) IC8.S(S123) JP5.1 JP5.3 Q11.2(E) Q13.2(E) Q14.2(E) R97.2 R98.2 R99.2 R100.2 R115.1 R116.1 R117.2 R122.1 R139.1 R142.2 R146.1 Z6.1(A)
GNDIO: C112.2 D20.C IC8.D1(D5678) IC8.D2(D5678) IC8.D3(D5678) IC8.D(D5678) IC8.P$1(D5678) IC8.P$2(D5678) JP5.11 T5.E X4.1 X4.2
HO: D9.A Q3.1(G) R47.2
HS: C35.1 Q3.3(S) Q4.2(D) U3.16(HS) U4.1
I_FOR_REV_BAT_PROTEC: C84.2 IC5.3(A:+IN) IC5.7(B:OUT) R104.2 R132.2
I_OUT_ADC: C92.2 JP5.10 R118.2
I_PWM: JP5.4 R89.2
ISNS: C25.1 C34.2 R31.1 U3.6(ISNS)
LLC_VAC_IN1: B1.AC1 C4.1 C5.1 D6.A L1.3
LLC_VAC_IN2: B1.AC2 C4.2 C6.1 D7.A L1.4
LO: D8.A Q4.1(G) R46.2
N$2: R4.2 T1.1(B) Z1.3(C)
N$3: R1.2 R2.1
N$4: R39.1 R40.2
N$5: R112.1 R113.2
N$6: R95.1 R96.2
N$7: F1.1 X1.2
N$8: R24.1 Z3.1(A)
N$12: C85.2 C86.2 IC4.7(OUT) R106.1
N$15: C78.2 R91.2 R93.2
N$16: R32.1 U3.1(HV)
N$17: R5.2 R6.1
N$18: C35.2 D10.C U3.14(HB)
N$19: IC4.3(CC+) R93.1 R95.2
N$20: R88.2 R89.1 T3.B
N$21: Q10.3(C) R113.1 R114.2
N$22: IC4.4(CV-) R110.2 R114.1 R115.2
N$23: C32.1 R48.2 R49.1 U3.9(LL/SS)
N$24: IC4.2(CC-) R99.1 R103.2
N$25: C91.2 Q10.1(B) R117.1 R119.2
N$26: D6.C D7.C R32.2
N$27: R123.2 Z5.1(A)
N$28: C95.2 R123.1 R124.2
N$29: Q11.1(B) R121.1 R122.2
N$30: C7.2 C9.2 D1.C R4.1 T1.4(C)
N$31: OC2.2 Z5.3(C)
N$32: Q12.1(B) R132.1
N$34: C87.2 IC5.1(A:OUT) R111.2 R118.1
N$35: C80.2 IC4.8(VCC) R102.2
N$36: C84.1 IC5.6(B:-IN) R101.2 R104.1
N$37: IC5.5(B:+IN) R100.1
N$38: C87.1 IC5.2(A:-IN) R108.2 R111.1
N$39: R40.1 R41.2
N$40: R42.1 R43.2
N$41: R38.1 R39.2
N$43: D18.C R140.2 R141.2
N$45: C86.1 R110.1
N$46: Q13.1(B) R139.2 Z8.1(A)
N$47: TRF1.3 TRF1.16 TRF1.35 TRF1.52 U4.2
N$48: Q10.2(E) R116.2
N$50: D10.A R50.2
N$51: C23.1 OC1.4 OC2.4 R24.2 U3.5(FB)
N$52: R45.1 R47.1 U3.15(HO)
N$53: R44.1 R46.1 U3.10(LO)
N$54: C33.1 C34.1 C36.1 TRF1.55 TRF1.56 TRF1.57 TRF1.58
N$55: R88.1 R90.2 R92.2 T3.E
N$57: C14.1 R12.2 U1.3(ISNS)
N$58: R11.1 T2.1(D)
N$59: D4.A Q2.G R21.1 R22.1
N$60: R13.1 R14.2 U1.4(FREQ)
N$61: C12.1 Q1.3(C) R8.1 R9.2
N$62: Q11.3(C) R124.1 Z6.3(C)
N$63: TRF1.1 TRF1.2 TRF1.17 TRF1.18 TRF1.36 TRF1.37 TRF1.53 TRF1.54
N$65: C1.1 C3.1 L1.2 NTC1.P$1 VR1.1
N$68: C20.1 D5.A Q2.D R23.1 R25.1 R26.1 R30.1 U2.2
N$69: R6.2 R7.2 Z2.3(C)
N$70: C16.1 R15.1
N$71: C13.1 U1.2(ICOMP)
N$73: D9.C R45.2
N$74: Q5.G R61.1 R65.2
N$75: C20.2 R27.2 R28.2 R29.2
N$76: C21.2 R23.2 R25.2 R26.2 R30.2
N$77: IC2.2(2.MIN_TOFF) R64.1
N$78: D8.C R44.2
N$80: B1.+ C8.1 D3.A R5.1 R13.2 U2.1
N$82: R140.1 R144.1 Z8.3(C)
N$83: NTC1.P$2 X1.1
N$84: C18.1 R15.2 U1.5(VCOMP)
N$85: R90.1 R91.1 T3.C
N$88: D20.A R148.2 T5.B
N$93: R33.1 R34.2
N$94: R34.1 R35.2
N$97: R35.1 R36.2
N$98: R36.1 R37.2
N$99: R144.2 T5.C
N$100: IC2.3(3.MIN_TON) R63.1
N$103: Q14.1(B) R141.1 R142.1
N$105: IC2.8(8.DRV) R65.1
N$106: C39.2 R54.1 R55.1 R56.1
N$112: C39.1 D11.C IC2.6(6.CS) Q5.D TRF1.8 TRF1.23 TRF1.28 TRF1.42
N$115: R9.1 R10.2 T2.3(G)
N$117: Q1.1(B) Z2.1(A)
N$118: B1.- C8.2 R12.1 R17.1 R18.1
N$119: Q7.G R78.1 R83.2
N$121: IC3.2(2.MIN_TOFF) R82.1
N$122: IC3.3(3.MIN_TON) R81.1
N$123: IC3.8(8.DRV) R83.1
N$124: C51.2 R68.1 R69.1 R70.1
N$125: R18.2 R20.1
N$126: R17.2 R19.1
N$128: C51.1 D13.C IC3.6(6.CS) Q7.D TRF1.9 TRF1.10 TRF1.21 TRF1.22 TRF1.29 TRF1.30 TRF1.43 TRF1.44
N$254: C85.1 R103.1
NEUTRAL: C2.1 C3.2 F1.2 L1.1 VR1.2
OUTPUT_REVERSE: JP5.12 Q13.3(C)
OVER_VOLT: JP5.8 R121.2
PE: C1.2 C2.2 C5.2 C6.2 C53.2 C58.2 C58.4 C90.1 C110.2 C111.2 C112.1 X1.3 ; supply symbol labelled EARTH
Q1_GATE: D4.C R21.2 U1.8(GATE)
RES: C43.2 C54.2 IC2.4(4.LLD) IC3.4(4.LLD) R62.1 R80.1
RVCC_12V: C15.1 C17.1 R8.2 R48.1 R50.1 U1.7(VCC) U3.12(RVCC) Z3.3(C)
S3: C24.P$2 C43.1 C49.1 C50.1 C53.1 C54.1 C55.1 C56.1 C59.2 C61.- C61.-1(-) C62.- C62.-1(-) C64.- C64.-1(-) C65.- C65.-1(-) C79.2 D11.A D13.A IC2.5(5.TRIG) IC2.7(7.GND) IC3.5(5.TRIG) IC3.7(7.GND) IC5.4(P:V-) Q5.S Q7.S Q12.2(E) R51.2 R54.2 R55.2 R56.2 R61.2 R62.2 R63.2 R64.2 R68.2 R69.2 R70.2 R78.2 R80.2 R81.2 R82.2 R96.1 R97.1 R98.1 R101.1 R108.1 Z9.1(A)
U3-K: OC1.2 R106.2
V_PWM: JP5.2 R119.1
VAC_AUX: D1.A R1.1 TRF1.5 TRF1.15 TRF1.34 TRF1.50
VCC: C26.+ C27.1 D2.C U3.3(VCC)
VCR: C28.1 C30.1 C36.2 U3.7(VCR)
VDC_AUX: C10.2 C11.2 D2.A T1.3(E)
VOUT: C22.1 C31.1 C38.+ D3.C D5.K(C) Q3.2(D) R27.1 R28.1 R29.1 R33.2 R38.2
VREF2.1: IC4.1(VREF) IC4.5(CV+) R92.1
VSENSE: C19.1 R11.2 R16.2 R37.1 U1.6(VSNS)

## Notes on the sheet
- MICROCONTROLLER
- USB
- AUX SUPPLY | LLC CONT.
- PRIMER
- CS400060
- LLC STAGE
- FİZİKSEL PAKETE GÖRE YENİDEN
   KÜTÜPHANE OLUŞTURULACAK
- 38*25mm olacak
- ve E36/18/11 için alternatğf pad
   ilave edilecek
- E30/15/7
- E42/21/15
- SECONDER
- FİZİKSEL PAKETE GÖRE YENİDEN
   KÜTÜPHANE OLUŞTURULACAK
- FİZİKSEL PAKETE GÖRE YENİDEN
   KÜTÜPHANE OLUŞTURULACAK
- Over voltage protection | Rev. Bat. Protection
- AUXILIARY VOLTAGE REGULATOR
- STM32G030F6P6
- ISOLATION BARRIER
- ISOLATED CONVERTER

## Library data of the parts
B1 = ENKO2:DıODE_BRIDGE_8A_DIK
C1-C23 C25 C27-C36 C39 C43 C49-C51 C53-C56 C59 C72-C75 C78-C80 C84-C87 C90-C92 C95 C98 C103 C108 C110-C112 = rcl:C-EU: CAPACITOR, European symbol
C24 = ENKO2:C075-32X103_DEIF
C26 C38 = rcl:CPOL-EU: POLARIZED CAPACITOR, European symbol
C58 = ENKO2:C075-32X103/C050-035X75
C61 C62 C64 C65 = ENKO2:E5-13/E7,5-16
D1 D2 D4 D8-D10 D18 D20 = diode:DIODE-: DIODE
D3 = enko:DIODE_D0201-23
D5 = enko:DIODE_12A_1000V_TO220
D6 D7 = enko:M7_DC_DIYOT
D11 D13 = diode:BYW80: DIODE high-efficiency fast recovery rectifier (ST)
F1 = fuse:19560: FUSE HOLDER TR5, Wickmann; MPN: 56000001009; OC_FARNELL: 1185363; OC_NEWARK: 15P8392
IC2 IC3 = enko:NCP4306
IC4 = mutlu:TSM1011
IC5 = linear:LMV358?*: Dual General Purpose, Low Voltage, Rail-to-Rail Output Operational Amplifiers Source: http://www.national.com/mpf/LM/LMV321.html http://www.national.com/dt/lmv_qual.pdf
IC8 = enko:TPH6R30ANL
JP5 = pinhead-fixdrills:PINHD-2X6: PIN HEADER
L1 = enko:EPCOS_B82724J
NTC1 = enko:SENS_NTC
OC1 OC2 = enko:PS2561DL2-1_OPTO1
PCB = BOM:PCB
Q1 Q10-Q14 = transistor-npn:BC846*: NPN Transistor
Q2 = transistor-power:PMOSFET_N: Power MOSFET N-Channel
Q3 Q4 = enko:ISO_TO_220
Q5 Q7 = transistor-power:STP5NA50: N-CHANNEL MOS FET
R1-R51 R54-R56 R61-R65 R68-R70 R78 R80-R83 R88-R93 R95-R104 R106 R108 R110-R119 R121-R124 R128 R132 R135 R139-R142 R144 R146 R148 = rcl:R-EU_: RESISTOR, European symbol
T1 = transistor:MJD31*: Complementary Power Transistors
T2 = zetex:NMOSSOT23: MOS FET; OC_FARNELL: unknown; OC_NEWARK: unknown
T3 T5 = transistor:*-PNP-: PNP Transistror
TRF1 = ENKO2:DEIF_TRF_300W_2
U1 = ENKO2:UCC28180
U2 U4 = mutlu:IND_TOROID
U3 = ENKO2:UCC256301
VR1 = enko:VITRA_VARISTOR
X1 = con-phoenix-762:GMSTBA3: PHOENIX; MF: FARNELL; MPN: 1757255; OC_FARNELL: 3705183; OC_NEWARK: 71C4162
X1-K X2-K = BOM:SOKET
X4 = con-phoenix-508:MSTBA4: PHOENIX; MF: FARNELL; MPN: 1757268; OC_FARNELL: 3705195; OC_NEWARK: 71C4163
Z1-Z3 Z5 Z6 Z8 Z9 = diode:ZENER-DIODE: Z-Diode